# Altium project GimbDrive.PrjPcb
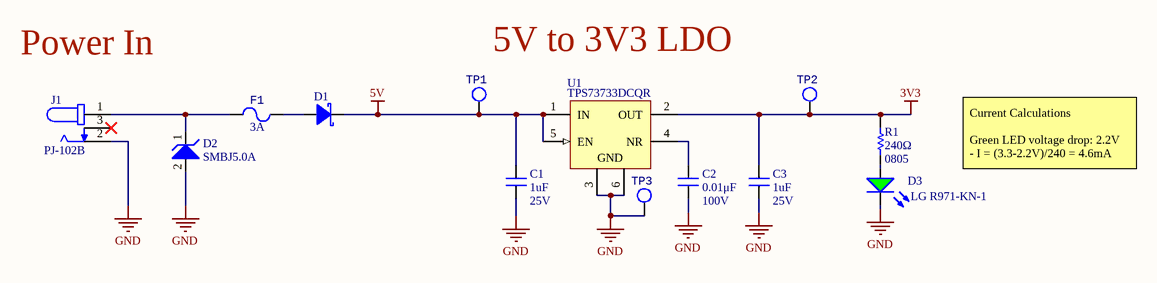
[diagram p0: SH1-POWER.SchDoc]
4 sheets, 114 parts. Net scope: flat (ports and power ports of the same name join across sheets).
Sheets:
  SH1-POWER.SchDoc
  SH2-MCU.SchDoc
  SH3-USB AND UART.SchDoc
  SH4-CONTROLS.SchDoc

## Sheet SH1-POWER.SchDoc: RC GimbDrive - Power
size Letter; DrawnBy: Christopher Arjune; SheetNumber: 1; SheetTotal: 4

### Parts
C1  Capacitance: 1uF  Voltage Rating (DC): 25V  [CAPC2012X140N]
C2  value 0.01μF  Voltage Rating: 100V  [CAP2012]  (hidden comment: CAP_0.01uF_100V_0805)
C3  Capacitance: 1uF  Voltage Rating (DC): 25V  [CAPC2012X140N]
D1  DIO_SCHOTTKY_30V_2A  [SOD-128]  (value not drawn)
D2  TVS_DIODE_UNIDIR_5V  [SMBJ5.0A]  (value not drawn)
D3  LG R971-KN-1  [LED_0805_LINE]
F1  Current Rating: 3A  [FUSE_1206]  (hidden comment: FUSE_3A_1206)
J1  PJ-102B  [CUI_PJ-102B]
R1  Resistance: 240Ω  Case Code (Imperial): 0805  [RESC2012X60N]  (hidden comment: 240)
TP1  TESTPOINT_LOOP  [TESTPOINT_LOOP]  (value not drawn)
TP2  TESTPOINT_LOOP  [TESTPOINT_LOOP]  (value not drawn)
TP3  TESTPOINT_LOOP  [TESTPOINT_LOOP]  (value not drawn)
U1  TPS73733DCQR  [SOT-223-6]

### Nets
3V3: C3.2 R1.2 TP2.1 U1.2(OUT)
5V: C1.1 D1.2(Cathode) TP1.1 U1.1(IN) U1.5(EN)
GND: C1.2 C2.1 C3.1 D2.2 D3.2(K) J1.2 TP3.1 U1.3(GND) U1.6(GND)
NetC2_2: C2.2 U1.4(NR)
NetD1_1: D1.1(Anode) F1.2
NetD2_1: D2.1 F1.1 J1.1
NetD3_1: D3.1(A) R1.1

Not connected (* = marked no-connect by the designer): J1 3*

### Notes on the sheet
- (near J1) Power In
- 5V to 3V3 LDO
- Current Calculations
  Green LED voltage drop: 2.2V
  - I = (3.3-2.2V)/240 = 4.6mA
- Title
- Size:
- Date:
- Letter
- Drawn By:
- Sheet
- of
- File:

### Library data of the parts
C1 C3 = CAP_1uF_25V_0805: CAP CER 1UF 25V X7R 0805; Manufacturer 1: Murata; Manufacturer Part Number 1: GCM21BR71E105KA56K; Tolerance: 10%; Supplier 1: Digi-Key; Stock 1: 31473; Pricing 1: 1=0.34000, 10=0.23600, 100=0.13360, 500=0.09432, 1000=0.08254, 2500=0.07861, 5000=0.07271 (USD); RoHS: Yes; Mount: Surface Mount; Case/Package: 0805; Case Code (Metric): 2012; Case Code (Imperial): 0805; Min Operating Temperature: -55°C; Max Operating Temperature: 125°C; Package Quantity: 10000; Voltage Rating: 25V; Packaging: Tape and Reel; Dielectric: X7R; Termination: SMD/SMT; Length: 2mm; Height: 1.25mm; Width: 0.049inch; Thickness: 0.055inch; Depth: 1.25mm; Ratings: AEC-Q200; Radiation Hardening: No; ComponentLink1URL: https://datasheet.ciiva.com/169/product-169236.pdf?src-supplier=Digi-Key; ComponentLink1Description: https://datasheet.ciiva.com/169/product-169236.pdf?src-supplier=Digi-Key; ComponentLink2URL: https://datasheet.ciiva.com/11616/product-11616618.pdf?src-supplier=Avnet; ComponentLink2Description: https://datasheet.ciiva.com/11616/product-11616618.pdf?src-supplier=Avnet; Supplier Part Number 1: 490-14743-1-ND
C2 = CAP_0.01uF_100V_0805: CAP CER 10000PF 100V X7R 0805; Manufacturer 1: KEMET; Manufacturer Part Number 1: C0805C103K1RACTU; Tolerance: 10%; Mount: Surface Mount; Case Code (Metric): 2012; Case Code (Imperial): 0805; Min Operating Temperature: -55°C; Max Operating Temperature: 125°C; Termination: SMD/SMT; Supplier 1: Digi-Key; Supplier Part Number 1: 399-1159-1-ND; Package: 0805 (2012 Metric); Dielectric: X7R
D1 = DIO_SCHOTTKY_30V_2A: DIODE SCHOTTKY 30V 2A PMDTM; Manufacturer 1: Rohm Semiconductor; Manufacturer Part Number 1: RSX205LAM30TR; Vf (Max): 490mV; Supplier 1: Digi-Key; Supplier Part Number 1: RSX205LAM30CT-ND; Mount: Surface Mount; Vr (Max): 30V; Io: 2A
D2 = TVS_DIODE_UNIDIR_5V: TVS DIODE 5V 9.2V DO214AA; Manufacturer 1: Bourns; Operating Supply Voltage: 3.5V; Max Surge Current: 100A; Reverse Breakdown Voltage: 6.4V; Peak Pulse Power: 600W; Power Line Protection: No; Breakdown Voltage: 7.25V; Number of Channels: 1; Polarity: Unidirectional; Max Reverse Leakage Current: 800uA; Test Current: 10mA; Peak Pulse Current: 65.2A; Supplier 1: Digi-Key; Mount: Surface Mount; Number of Pins: 2; Min Operating Temperature: -55°C; Max Operating Temperature: 150°C; Reverse Standoff Voltage: 5V; Clamping Voltage: 9.2V; Max Power Dissipation: 600W; Max Breakdown Voltage: 7.25V; Leakage Current: 800uA; Composition: Zener; Supplier Part Number 1: SMBJ5.0ABCT-ND; Zener Voltage: *; Min Breakdown Voltage: 6.4V; Manufacturer Part Number 1: SMBJ5.0A
D3 = DIO_LED_G: LED GREEN DIFFUSED 0805 SMD; Manufacturer 1: OSRAM; Forward Voltage Drop: 2.2V; Package: 0805 (2012 Metric); Manufacturer Part Number 1: LG R971-KN-1; Supplier Part Number 1: 475-1410-1-ND; Supplier 1: Digi-Key; Mount: Surface Mount
F1 = FUSE_3A_1206: FUSE SMD 3A 32V 1206; Manufacturer 1: Littelfuse; Manufacturer Part Number 1: 0466003.NR; DC Cold Resistance: 0.02R; Power Dissipation: 228mW; Fuse Type: Board Mount (Cartridge Style Excluded); Approvals: UL,CSA; Response Time: Fast Blow; Supplier 1: Digi-Key; Mount: Surface Mount; Case/Package: 1206; Number of Pins: 2; Case Code (Metric): 3216; Case Code (Imperial): 1206; Min Operating Temperature: -55°C; Max Operating Temperature: 90°C; Voltage Rating (AC): 32V; Voltage Rating (DC): 32V; Composition: Thin Film; Resistance: 0.02R; Fuse Current: 3A; Working Voltage: 32V; Length: 3.18mm; Height: 0.023inch; Width: 1.52mm; REACH SVHC: Unknown; Supplier Part Number 1: F1458CT-ND
J1 = PJ-102B: CONN PWR JACK 2.5X5.5MM SOLDER; Manufacturer 1: CUI; Gender: Male; Shielding: Unshielded; Current Rating: 2.5A; Voltage Rating: 24V; Insulation Resistance: 100MR; Number of Conductors: 2; Supplier 1: Digi-Key; Manufacturer Part Number 1: PJ-102B; Mount: Through Hole; Color: Black; Contact Plating: Nickel; Contact Material: Copper; Housing Material: Thermoplastic; Housing Color: Black; Min Operating Temperature: -25°C; Max Operating Temperature: 85°C; Termination: Through Hole; Connector Type: Jack; Contact Gender: Male; Orientation: Horizontal; Diameter: 2.5mm; Flammability Rating: UL94 V-0; Supplier Part Number 1: CP-102B-ND
R1 = RES_120Ω_0805_1%: RES 240 OHM 1% 1/8W 0805; Manufacturer 1: Vishay; Manufacturer Part Number 1: CRCW0805240RFKEA; Temperature Coefficient: 100ppm/°C; Max Power Dissipation: 125mW; Voltage Rating (DC): 150V; Supplier 1: Digi-Key; Stock 1: 27214; Pricing 1: 1=0.10000, 10=0.05700, 100=0.02310, 1000=0.01039, 2500=0.00902 (USD); RoHS: Yes; Case/Package: 0805; Case Code (Metric): 2012; Contact Plating: Tin; Weight: 0.000194oz; Min Operating Temperature: -55°C; Max Operating Temperature: 155°C; Tolerance: 1%; Packaging: Tape and Reel; Package Quantity: 10; Resistor Type: Thick Film; Number of Terminations: 2; Features: Automotive AEC-Q200; Power Rating: 125mW; Voltage Rating: 150V; Termination: SMD/SMT; Length: 2mm; Width: 0.049inch; Height: 0.45mm; Depth: 1.25mm; Radiation Hardening: No; Lead Free: Lead Free; REACH SVHC: Unknown; Military Standard: Not; ComponentLink1URL: https://datasheet.ciiva.com/11810/0900766b80d98b26-11810664.pdf?src-supplier=RSComponents; ComponentLink1Description: https://datasheet.ciiva.com/11810/0900766b80d98b26-11810664.pdf?src-supplier=RSComponents; ComponentLink2URL: https://datasheet.ciiva.com/2467/dcrcwe3-2467397.pdf?src-supplier=Digi-Key; ComponentLink2Description: https://datasheet.ciiva.com/2467/dcrcwe3-2467397.pdf?src-supplier=Digi-Key; ComponentLink3URL: https://datasheet.ciiva.com/5541/dcrcwe3-109170-5541461.pdf?src-supplier=Mouser; ComponentLink3Description: https://datasheet.ciiva.com/5541/dcrcwe3-109170-5541461.pdf?src-supplier=Mouser; ComponentLink4URL: https://datasheet.ciiva.com/2467/dcrcwe3-2467395.pdf?src-supplier=Digi-Key; ComponentLink4Description: https://datasheet.ciiva.com/2467/dcrcwe3-2467395.pdf?src-supplier=Digi-Key; ComponentLink5URL: https://datasheet.ciiva.com/2467/dcrcwe3-2467396.pdf?src-supplier=Digi-Key; ComponentLink5Description: https://datasheet.ciiva.com/2467/dcrcwe3-2467396.pdf?src-supplier=Digi-Key; ComponentLink6URL: https://datasheet.ciiva.com/15159/getdatasheetpartid-101887-15159995.pdf?src-supplier=Verical; ComponentLink6Description: https://datasheet.ciiva.com/15159/getdatasheetpartid-101887-15159995.pdf?src-supplier=Verical; ComponentLink7URL: https://datasheet.ciiva.com/16435/dcrcwe3-16435931.pdf?src-supplier=Future+Electronics; ComponentLink7Description: https://datasheet.ciiva.com/16435/dcrcwe3-16435931.pdf?src-supplier=Future+Electronics; ComponentLink8URL: https://datasheet.ciiva.com/26317/fld-crcw-e3-data-en-26317341.pdf?src-supplier=Distrelec; ComponentLink8Description: https://datasheet.ciiva.com/26317/fld-crcw-e3-data-en-26317341.pdf?src-supplier=Distrelec; Supplier Part Number 1: 541-240CCT-ND
TP1-TP3 = TESTPOINT_LOOP: Loop testpoint through-hole pad; Manufacturer 1: Keystone Electronics; Manufacturer Part Number 1: 5002; Supplier Part Number 1: 36-5002-ND; Supplier 1: Digi-Key; Mount: Through Hole
U1 = CMP-0395-00300-2: IC REG LINEAR 3.3V 1A SOT223-6; Manufacturer: Texas Instruments; Fixed Output Options(V): 3.3; Vdo(Typ)(mV): 130; Iout(Max)(A): 1; Accuracy(%): 3; SubFamily: Single Channel LDO; Eco-Plan: Green (RoHS & no Sb/Br); Vin(Min)(V): 2.2; Vin(Max)(V): 5.5; Rating: Catalog; Iq(Typ)(mA): 0.3; PartNumber: TPS73733DCQR; DatasheetVersion: SBVS067O; PackageReference: DCQ0006A; PackageDescription: 6-Pin Plastic Small Outline, Body 3.5 x 6.5 mm, Pitch 1.27 mm; PackageVersion: 4202109/D; Vout Adj(Min)(V): 3.3; Vout Adj(Max)(V): 3.3; Mounting Technology: Surface Mount; Supplier 1: Digi-Key; Supplier Part Number 1: 296-22681-2-ND; Manufacturer 1: Texas Instruments; Manufacturer Part Number 1: TPS73733DCQR

## Sheet SH2-MCU.SchDoc: RC GimbDrive - Microcontroller
size Letter; DrawnBy: Christopher Arjune; SheetNumber: 2; SheetTotal: 4
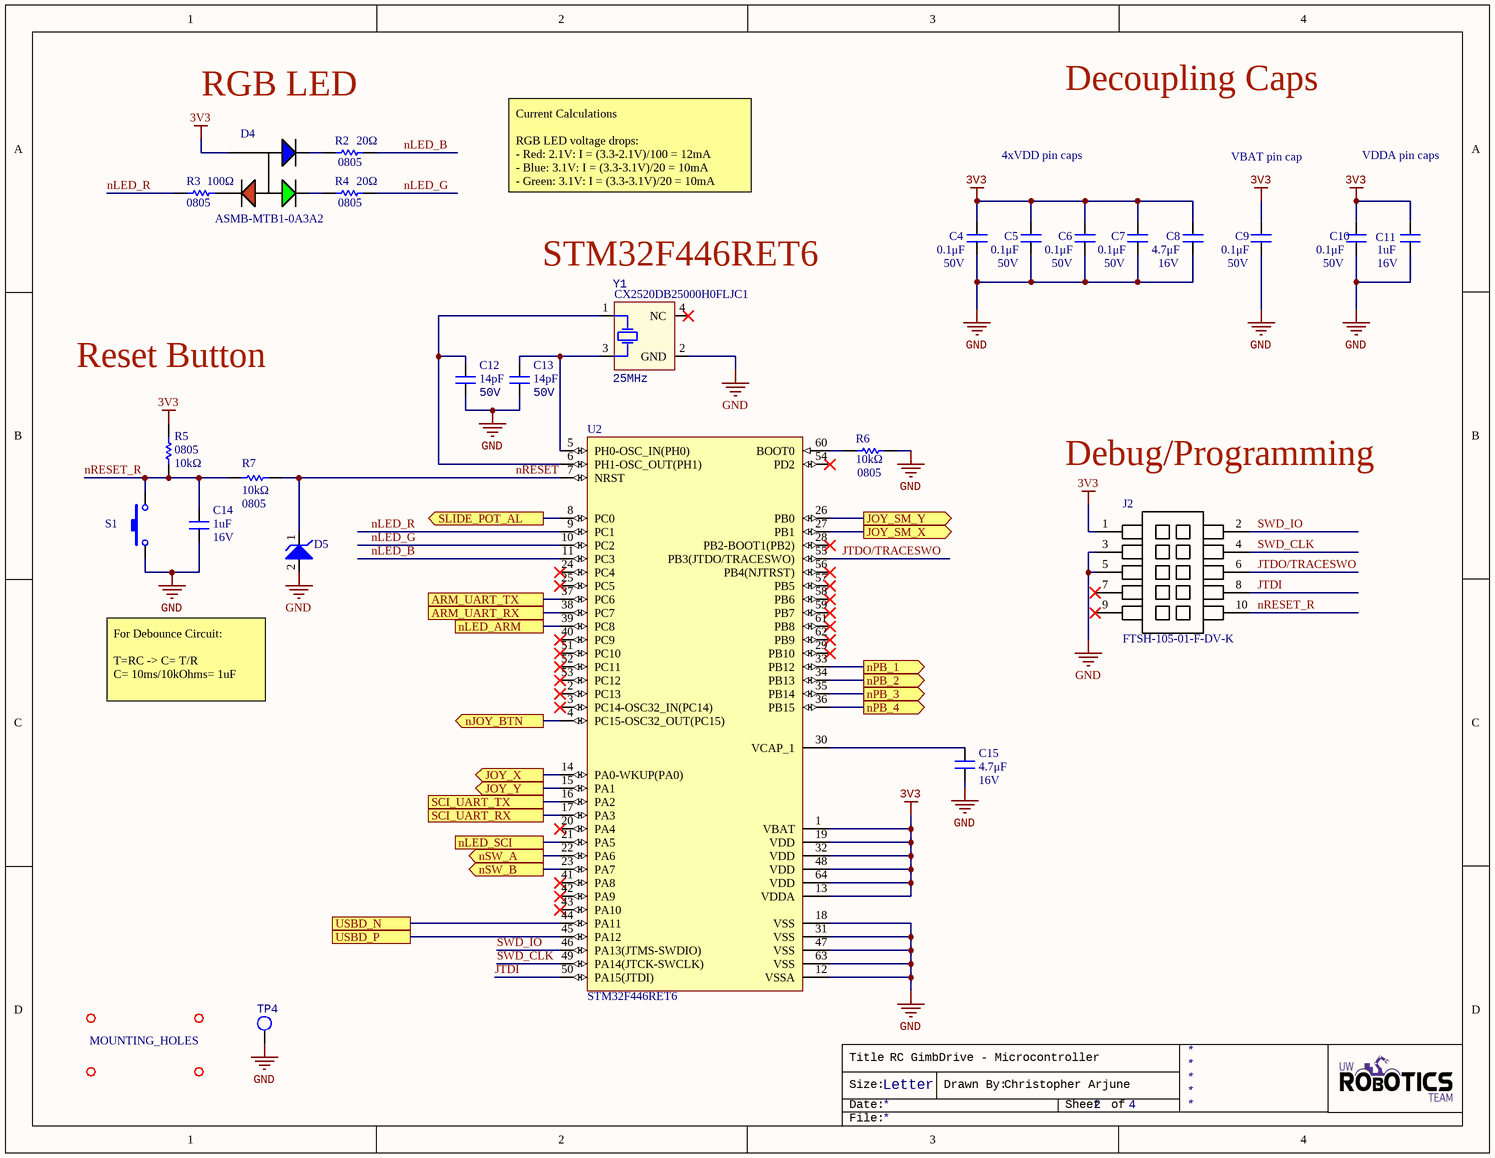
[diagram p1: SH2-MCU.SchDoc]

### Parts
C4  Voltage Rating: 50V  [CAPC2012X140N]  (hidden comment: 0.1μF)
C5  Voltage Rating: 50V  [CAPC2012X140N]  (hidden comment: 0.1μF)
C6  Voltage Rating: 50V  [CAPC2012X140N]  (hidden comment: 0.1μF)
C7  Voltage Rating: 50V  [CAPC2012X140N]  (hidden comment: 0.1μF)
C8  value 4.7μF  Voltage Rating: 16V  [CAPC2012X140N]  (hidden comment: CAP_4.7uF_16V_0805)
C9  Voltage Rating: 50V  [CAPC2012X140N]  (hidden comment: 0.1μF)
C10  Voltage Rating: 50V  [CAPC2012X140N]  (hidden comment: 0.1μF)
C11  value 1uF  Voltage Rating: 16V  [CAPC2012X140N]  (hidden comment: CAP_1uF_16V_0805)
C12  value 14pF  Voltage Rating (DC): 50V  [CAPC0603(1608)55_N]  (hidden comment: CL10C140JB8NNNC)
C13  value 14pF  Voltage Rating (DC): 50V  [CAPC0603(1608)55_N]  (hidden comment: CL10C140JB8NNNC)
C14  value 1uF  Voltage Rating: 16V  [CAPC2012X140N]  (hidden comment: CAP_1uF_16V_0805)
C15  value 4.7μF  Voltage Rating: 16V  [CAPC2012X140N]  (hidden comment: CAP_4.7uF_16V_0805)
D4  Manufacturer Part Number 1: ASMB-MTB1-0A3A2  [LED_RGB]  (hidden comment: LED_RGB)
D5  TVS_DIODE_UNIDIR_3.3V  [SOD523]  (value not drawn)
J2  Manufacturer Part Number 1: FTSH-105-01-F-DV-K  [FTSH-105-01-F-DV-K-P-TR]  (hidden comment: CON_PROGRAMMING)
MH1  MOUNTING_HOLES  [MOUNTING_HOLE]  (value not drawn)
MH2  MOUNTING_HOLES  [MOUNTING_HOLE]  (value not drawn)
MH3  MOUNTING_HOLES  [MOUNTING_HOLE]
MH4  MOUNTING_HOLES  [MOUNTING_HOLE]  (value not drawn)
R2  value 20Ω  Case Code (Imperial): 0805  [RESC2012X60N]  (hidden comment: RES_20Ω_0805)
R3  value 100Ω  Case Code (Imperial): 0805  [RESC2012X60N]  (hidden comment: RES_100Ω_0805)
R4  value 20Ω  Case Code (Imperial): 0805  [RESC2012X60N]  (hidden comment: RES_20Ω_0805)
R5  value 10kΩ  Case Code (Imperial): 0805  [RESC2012X60N]  (hidden comment: RES_10kΩ_0805)
R6  value 10kΩ  Case Code (Imperial): 0805  [RESC2012X60N]  (hidden comment: RES_10kΩ_0805)
R7  value 10kΩ  Case Code (Imperial): 0805  [RESC2012X60N]  (hidden comment: RES_10kΩ_0805)
S1  SW_TACTILE  [B3U-1000P]  (value not drawn)
TP4  TESTPOINT_LOOP  [TESTPOINT_LOOP]  (value not drawn)
U2  STM32F446RET6  [STM-LQFP64_L]
Y1  Manufacturer Part Number 1: CX2520DB25000H0FLJC1  Frequency: 25MHz  [SOIC254P1016X440-4N]  (hidden comment: CRYSTAL_25MHZ)

### Ports
ARM_UART_RX, ARM_UART_TX, JOY_SM_X (out), JOY_SM_Y (out), JOY_X (out), JOY_Y (out), nJOY_BTN (out), nLED_ARM, nLED_SCI, nPB_1 (out), nPB_2 (out), nPB_3 (out), nPB_4 (out), nSW_A (out), nSW_B (out), SCI_UART_RX, SCI_UART_TX, SLIDE_POT_AL (out), USBD_N, USBD_P

### Nets
3V3: C4.2 C5.2 C6.2 C7.2 C8.2 C9.2 C10.2 C11.2 D4.4 J2.1 R5.2 U2.1(VBAT) U2.13(VDDA) U2.19(VDD) U2.32(VDD) U2.48(VDD) U2.64(VDD)
GND: C4.1 C5.1 C6.1 C7.1 C8.1 C9.1 C10.1 C11.1 C12.1 C13.1 C14.1 C15.1 D5.2 J2.3 J2.5 R6.2 S1.2 TP4.1 U2.12(VSSA) U2.18(VSS) U2.31(VSS) U2.47(VSS) U2.63(VSS) Y1.2(GND)
JTDI: J2.8 U2.50(PA15(JTDI))
JTDO/TRACESWO: J2.6 U2.55(PB3(JTDO/TRACESWO))
nLED_B: R2.2 U2.11(PC3)
nLED_G: R4.2 U2.10(PC2)
nLED_R: R3.1 U2.9(PC1)
nRESET: D5.1 R7.2 U2.7(NRST)
nRESET_R: C14.2 J2.10 R5.1 R7.1 S1.1
SWD_CLK: J2.4 U2.49(PA14(JTCK-SWCLK))
SWD_IO: J2.2 U2.46(PA13(JTMS-SWDIO))
USBD_N: U2.44(PA11) ; port USBD_N
USBD_P: U2.45(PA12) ; port USBD_P
NetC12_2: C12.2 U2.6(PH1-OSC_OUT(PH1)) Y1.1(HOT)
NetC13_2: C13.2 U2.5(PH0-OSC_IN(PH0)) Y1.3(HOT)
NetC15_2: C15.2 U2.30(VCAP_1)
NetC17_2: U2.8(PC0) ; port SLIDE_POT_AL
NetC18_2: U2.33(PB12) ; port nPB_1
NetC19_2: U2.26(PB0) ; port JOY_SM_Y
NetC20_2: U2.27(PB1) ; port JOY_SM_X
NetC21_2: U2.34(PB13) ; port nPB_2
NetC22_2: U2.35(PB14) ; port nPB_3
NetC23_2: U2.4(PC15-OSC32_OUT(PC15)) ; port nJOY_BTN
NetC24_2: U2.14(PA0-WKUP(PA0)) ; port JOY_X
NetC25_2: U2.15(PA1) ; port JOY_Y
NetC26_2: U2.36(PB15) ; port nPB_4
NetC27_2: U2.22(PA6) ; port nSW_A
NetC28_2: U2.23(PA7) ; port nSW_B
NetD4_1: D4.1 R3.2
NetD4_2: D4.2 R4.1
NetD4_3: D4.3 R2.1
NetD9_1: U2.38(PC7) ; port ARM_UART_RX
NetD10_1: U2.37(PC6) ; port ARM_UART_TX
NetD12_1: U2.17(PA3) ; port SCI_UART_RX
NetD13_1: U2.16(PA2) ; port SCI_UART_TX
NetR6_1: R6.1 U2.60(BOOT0)
NetR11_1: U2.39(PC8) ; port nLED_ARM
NetR12_1: U2.21(PA5) ; port nLED_SCI

Not connected (* = marked no-connect by the designer): J2 7* 9*; U2 2(PC13)* 3(PC14-OSC32_IN(PC14))* 20(PA4)* 24(PC4)* 25(PC5)* 28(PB2-BOOT1(PB2))* 29(PB10)* 40(PC9)* 41(PA8)* 42(PA9)* 43(PA10)* 51(PC10)* 52(PC11)* 53(PC12)* 54(PD2)* 56(PB4(NJTRST))* 57(PB5)* 58(PB6)* 59(PB7)* 61(PB8)* 62(PB9)*; Y1 4(NC)*

### Notes on the sheet
- RGB LED
- Decoupling Caps
- 4xVDD pin caps
- VBAT pin cap
- VDDA pin caps
- Current Calculations
  RGB LED voltage drops:
  - Red: 2.1V: I = (3.3-2.1V)/100 = 12mA
  - Blue: 3.1V: I = (3.3-3.1V)/20 = 10mA
  - Green: 3.1V: I = (3.3-3.1V)/20 = 10mA
- (near Y1) STM32F446RET6
- Reset Button
- Debug/Programming
- For Debounce Circuit:
  T=RC -> C= T/R
  C= 10ms/10kOhms= 1uF
- Title
- Size:
- Date:
- Letter
- Drawn By:
- Sheet
- of
- File:

### Library data of the parts
C4-C7 C9 C10 = CAP_0.1uF_50V_0805: CAP CER 0.1UF 50V X7R 0805; Manufacturer 1: Murata Electronics; Manufacturer Part Number 1: GCD21BR71H104KA01L; Tolerance: 10%; Mount: Surface Mount; Case Code (Metric): 2012; Case Code (Imperial): 0805; Min Operating Temperature: -55°C; Max Operating Temperature: 125°C; Dielectric: X7R; Termination: SMD/SMT; Length: 2mm; Height: 1.25mm; Width: 0.049inch; Thickness: 0.049inch; Depth: 1.25mm; Ratings: AEC-Q200; ComponentLink1URL: https://datasheet.ciiva.com/29537/c03e-29537701.pdf?src-supplier=Digi-Key; ComponentLink1Description: https://datasheet.ciiva.com/29537/c03e-29537701.pdf?src-supplier=Digi-Key; Supplier 1: Digi-Key; Supplier Part Number 1: 490-11955-1-ND; Value: 0.1μF; Package: 0805 (2012 Metric)
C8 C15 = CAP_4.7uF_16V_0805: CAP CER 4.7UF 16V X5R 0805; Manufacturer 1: Samsung Electro-Mechanics; Manufacturer Part Number 1: CL21A475KOFNNNE; Tolerance: 10%; Mount: Surface Mount; Case Code (Metric): 2012; Case Code (Imperial): 0805; Min Operating Temperature: -55°C; Max Operating Temperature: 85°C; Dielectric: X5R; Termination: SMD/SMT; Supplier 1: Digi-Key; Supplier Part Number 1: 1276-1065-1-ND; Package: 0805 (2012 Metric)
C11 C14 = CAP_1uF_16V_0805: CAP CER 1UF 16V X7R 0805; Manufacturer 1: Yageo; Manufacturer Part Number 1: CC0805KKX7R7BB105; Tolerance: 10%; Mount: Surface Mount; Case Code (Metric): 2012; Case Code (Imperial): 0805; Min Operating Temperature: -55°C; Max Operating Temperature: 125°C; Dielectric: X7R; Termination: SMD/SMT; Supplier 1: Digi-Key; Supplier Part Number 1: 311-1365-1-ND; Package: 0805 (2012 Metric)
C12 C13 = CL10C140JB8NNNC: Cap Ceramic 14pF 50V C0G 5% SMD 0603 125C Cardboard T/R; Manufacturer 1: Samsung; Voltage Rating: 50V; Supplier Part Number 1: 1276-2187-1-ND; Supplier 1: Digi-Key; Manufacturer Part Number 1: CL10C140JB8NNNC; Stock 1: 187088; Pricing 1: 1=0.10000, 10=0.06700, 100=0.02980, 500=0.02130, 1000=0.01673 (USD); RoHS: Yes; Mount: Surface Mount; Case/Package: 0603; Case Code (Metric): 1608; Case Code (Imperial): 0603; Min Operating Temperature: -55°C; Max Operating Temperature: 125°C; Tolerance: 5%; Package Quantity: 1; Packaging: Tape and Reel; Dielectric: C0G; Length: 1.6mm; Height: 0.8mm; Width: 0.031inch; Depth: 0.8mm; Thickness: 0.035inch; Radiation Hardening: No; ComponentLink1URL: https://datasheet.ciiva.com/25782/cl10c140jb8nnnc-25782947.pdf?src-supplier=Digi-Key; ComponentLink1Description: https://datasheet.ciiva.com/25782/cl10c140jb8nnnc-25782947.pdf?src-supplier=Digi-Key; Capacitance: 14pF
D4 = LED_RGB: LED RGB DIFFUSED 4PLCC SMD; Manufacturer 1: Broadcom; Color: Blue,Green,Red; Lens Color: White; Viewing Angle: 115°; Lens Style: Round; Luminous Intensity: 350mcd; Dominant Wavelength: 470nm; Forward Voltage: 3.1V; Test Current: 20mA; Supplier 1: Digi-Key; Stock 1: 142531; Pricing 1: 1=0.60000, 10=0.47100, 100=0.30210, 500=0.25980, 1000=0.20059 (USD); RoHS: Yes; Mount: Surface Mount; Case/Package: PLCC; Number of Pins: 4; Packaging: Cut Tape; Lens Transparency: Diffused; Length: 3.2mm; Height: 1.9mm; Width: 2.8mm; REACH SVHC: No SVHC; ComponentLink1URL: http://www.farnell.com/datasheets/2111106.pdf?src-supplier=Farnell; ComponentLink1Description: http://www.farnell.com/datasheets/2111106.pdf?src-supplier=Farnell; ComponentLink2URL: https://docs.broadcom.com/docs/AV02-4194EN?src-supplier=Digi-Key; ComponentLink2Description: https://docs.broadcom.com/docs/AV02-4194EN?src-supplier=Digi-Key; ComponentLink3URL: http://www.farnell.com/datasheets/1801564.pdf?src-supplier=Element14; ComponentLink3Description: http://www.farnell.com/datasheets/1801564.pdf?src-supplier=Element14; ComponentLink4URL: http://www.farnell.com/datasheets/2111106.pdf?src-supplier=Newark; ComponentLink4Description: http://www.farnell.com/datasheets/2111106.pdf?src-supplier=Newark; Supplier Part Number 1: 516-3280-1-ND
D5 = TVS_DIODE_UNIDIR_3.3V: TVS DIODE 3.3V 14.1V SOD523. Used to protect each connector input line going into the MCU.; Manufacturer 1: ON Semiconductor; Manufacturer Part Number 1: ESD5Z3.3T1G; Reverse Breakdown Voltage: 5V; Peak Pulse Power: 158W; Power Line Protection: No; Number of Channels: 1; Polarity: Unidirectional; Peak Pulse Current: 11.2A; Supplier 1: Digi-Key; Mount: Surface Mount; Number of Pins: 2; Min Operating Temperature: -55°C; Max Operating Temperature: 150°C; Reverse Standoff Voltage: 3.3V; Clamping Voltage: 14.1V; Composition: Zener; Supplier Part Number 1: ESD5Z3.3T1GOSCT-ND
J2 = CON_PROGRAMMING: Board Connector, 10 Contact(s), 2 Row(s), Male, Straight, 0.05 inch Pitch, Surface Mount Terminal, Locking; Manufacturer 1: Samtec; Number of Contacts: 10; Connector Type: Male Pin; Max Current Rating: 1.75A; Pitch: 1.27mm; Supplier 1: Digi-Key; RoHS: Yes; Category: Headers and Wire Housings; Stock 1: 19926; Pricing 1: 1=2.90000, 10=2.78400, 100=2.32000, 500=1.97200, 1000=1.68200, 5000=1.50800 (USD); Mount: Surface Mount; Contact Plating: Gold; Contact Material: Copper,Bronze; Housing Color: Black; Housing Material: Polymer; Color: Black; Min Operating Temperature: -55°C; Max Operating Temperature: 125°C; Number of Rows: 2; Termination: Solder; Packaging: Rail/Tube; Orientation: Straight; Package Quantity: 1; Number of Positions: 10; Length: 15.2mm; Height: 3.3mm; Depth: 3.43mm; Row Spacing: 0.05inch; Contact Mating Length: 0.12inch; Radiation Hardening: No; Lead Free: Lead Free; ComponentLink1URL: https://datasheet.ciiva.com:443/pdfs/VipMasterIC/IC/SAMI/SAMI-S-A0003531380/SAMI-S-A0003531380-1.pdf?src-supplier=IHS+Markit; ComponentLink1Description: https://datasheet.ciiva.com:443/pdfs/VipMasterIC/IC/SAMI/SAMI-S-A0003531380/SAMI-S-A0003531380-1.pdf?src-supplier=IHS+Markit; ComponentLink2URL: https://datasheet.ciiva.com/19461/2046846-19461026.pdf?src-supplier=Jameco; ComponentLink2Description: https://datasheet.ciiva.com/19461/2046846-19461026.pdf?src-supplier=Jameco; ComponentLink3URL: https://datasheet.ciiva.com/16657/ftsh-mt-16657371.pdf?src-supplier=Avnet+Europe; ComponentLink3Description: https://datasheet.ciiva.com/16657/ftsh-mt-16657371.pdf?src-supplier=Avnet+Europe; ComponentLink4URL: https://datasheet.ciiva.com/15195/getdatasheetpartid-133463-15195260.pdf?src-supplier=Verical; ComponentLink4Description: https://datasheet.ciiva.com/15195/getdatasheetpartid-133463-15195260.pdf?src-supplier=Verical; ComponentLink5URL: https://datasheet.ciiva.com/738/ftsh-1xx-xx-xxx-dv-xxx-mkt-738998.pdf?src-supplier=Digi-Key; ComponentLink5Description: https://datasheet.ciiva.com/738/ftsh-1xx-xx-xxx-dv-xxx-mkt-738998.pdf?src-supplier=Digi-Key; ComponentLink6URL: https://datasheet.ciiva.com/10245/ftsh-mt-10245273.pdf?src-supplier=Avnet; ComponentLink6Description: https://datasheet.ciiva.com/10245/ftsh-mt-10245273.pdf?src-supplier=Avnet; Supplier Part Number 1: SAM8796-ND
MH1-MH4 = MOUNTING_HOLES: 6cm x 6cm
R2 R4 = RES_20Ω_0805: RES SMD 20 OHM 1% 1/8W 0805; Manufacturer 1: Yageo; Manufacturer Part Number 1: RC0805FR-0720RL; Resistance: 20; Power Rating: 125mW; Supplier 1: Digi-Key; Case Code (Metric): 2012; Min Operating Temperature: -55°C; Max Operating Temperature: 155°C; Tolerance: 1%; Termination: SMD/SMT; Supplier Part Number 1: 311-20.0CRCT-ND; Package: 0805 (2012 Metric)
R3 = RES_100Ω_0805: RES SMD 100 OHM 1% 1/8W 0805; Manufacturer 1: Yageo; Manufacturer Part Number 1: RC0805FR-07100RL; Power Rating: 125mW; Supplier 1: Digi-Key; Mount: Surface Mount; Case Code (Metric): 2012; Supplier Part Number 1: 311-100CRCT-ND; Package: 0805 (2012 Metric)
R5-R7 = RES_10kΩ_0805: RES SMD 10K OHM 1% 1/8W 0805; Manufacturer 1: Yageo; Manufacturer Part Number 1: RC0805FR-0710KL; Power Rating: 125mW; Supplier 1: Digi-Key; Case Code (Metric): 2012; Min Operating Temperature: -55°C; Max Operating Temperature: 155°C; Resistance: 10K; Tolerance: 1%; Termination: SMD/SMT; Supplier Part Number 1: 311-10.0KCRCT-ND; Package: 0805 (2012 Metric)
S1 = SW_TACTILE: Tactile Switch (Grey); Manufacturer 1: Omron Electronics Inc-EMC Div; Manufacturer Part Number 1: B3U-1000P; Supplier 1: Digi-Key; Supplier Part Number 1: SW1020CT-ND; Mount: Surface Mount
TP4 = TESTPOINT_LOOP: Loop testpoint through-hole pad; Manufacturer Part Number 1: 5002; Manufacturer 1: Keystone Electronics; Supplier Part Number 1: 36-5002-ND; Supplier 1: Digi-Key; Mount: Through Hole
U2 = MCU_STM32F446RET6: ARM Cortex-M4 32-bit MCU+FPU, 512 KB Flash, 128 KB Internal RAM, 50 I/Os, 64-Pin LQFP, -40 to 85 degC, Tray; I/Os (High Current): 50; Supply Voltage(Vcc) min (V): 1.7; Operating Frequency(F) (Processor speed) (MHz): 180; D/A Converter: 2; Internal RAM Size (kB): 128; FLASH Size (Prog) (kB): 512; Core: ARM Cortex-M4; ComponentLink1Description: Manufacturer URL; Package Reference: 64-Pin Low-profile Quad Flat Package, Body 10 x 10 mm, Pitch 0.5 mm; ComponentLink2URL: http://www.st.com/st-web-ui/static/active/en/resource/technical/document/datasheet/DM00141306.pdf; Packing: Tray; DatasheetVersion: Rev. 6; ComponentLink1URL: http://www.st.com/; ComponentLink2Description: Datasheet; Package Description: LQFP64; Mounting Technology: Surface Mount; Supplier Part Number 1: 497-15376-ND; Supplier 1: Digi-Key
Y1 = CRYSTAL_25MHZ: CRYSTAL 25.0000MHZ 12PF SMD; Manufacturer 1: Kyocera AVX; ESR (Equivalent Series Resistance): 80R; Frequency Stability: 15ppm; Frequency Tolerance: 10ppm; ComponentLink1Description: https://media.digikey.com/pdf/Data%20Sheets/AVX%20PDFs/CX2520DB_USY1M-H1-16429-00_Spec.pdf?src-supplier=Digi-Key; ComponentLink1URL: https://media.digikey.com/pdf/Data%20Sheets/AVX%20PDFs/CX2520DB_USY1M-H1-16429-00_Spec.pdf?src-supplier=Digi-Key; Supplier 1: Digi-Key; Supplier Part Number 1: 1253-1724-1-ND; Stock 1: 11741; Pricing 1: 1=0.72000, 10=0.63300, 50=0.59120, 100=0.52250, 500=0.49500, 1000=0.41250 (USD); RoHS: Yes; Mount: Surface Mount; Case/Package: SMD/SMT; Min Operating Temperature: -30°C; Max Operating Temperature: 85°C; Packaging: Tape and Reel; Load Capacitance: 12pF; Length: 0.098inch; Height: 0.022inch; Width: 0.079inch; Ratings: AEC-Q200

## Sheet SH3-USB AND UART.SchDoc: RC GimbDrive - USB and UART
size Letter; DrawnBy: Christopher Arjune; SheetNumber: 3; SheetTotal: 4
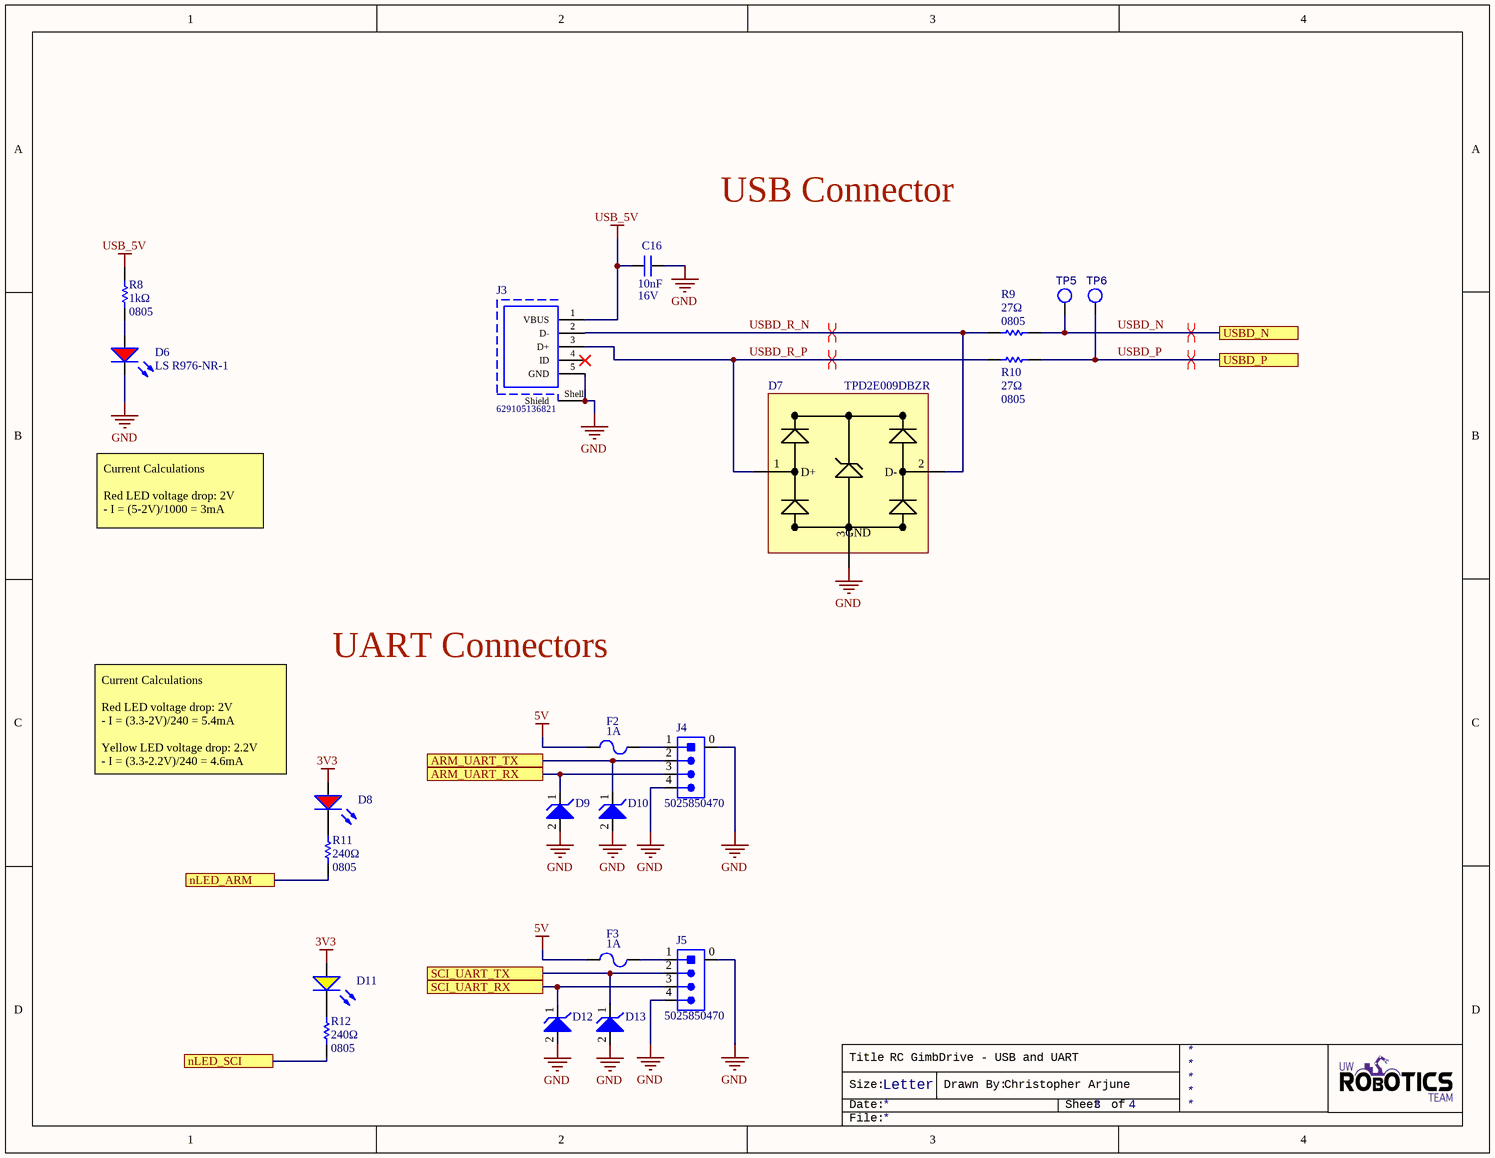
[diagram p2: SH3-USB AND UART.SchDoc]

### Parts
C16  Capacitance: 10nF  Voltage Rating: 16V  [CAPC2012X140N]
D6  LS R976-NR-1  [LED_0805_LINE]
D7  Manufacturer Part Number: TPD2E009DBZR  [SOT23-3]  (hidden comment: TVS_DIODE_USB_5.5V)
D8  LS R976-NR-1  [LED_0805_RED]  (value not drawn)
D9  TVS_DIODE_UNIDIR_3.3V  [SOD523]  (value not drawn)
D10  TVS_DIODE_UNIDIR_3.3V  [SOD523]  (value not drawn)
D11  LY R976-PS-36  [LED_0805_YELLOW]  (value not drawn)
D12  TVS_DIODE_UNIDIR_3.3V  [SOD523]  (value not drawn)
D13  TVS_DIODE_UNIDIR_3.3V  [SOD523]  (value not drawn)
F2  Current Rating: 1A  [FUSC3215X78N]  (hidden comment: FUSE_1A_1206)
F3  Current Rating: 1A  [FUSC3215X78N]  (hidden comment: FUSE_1A_1206)
J3  629105136821  [629105136821]
J4  Manufactor Number: 5025850470  [MOLEX-5025850470]  (hidden comment: CON_4M_SM_RA)
J5  Manufactor Number: 5025850470  [MOLEX-5025850470]  (hidden comment: CON_4M_SM_RA)
R8  1kΩ  Case Code (Imperial): 0805  [RESC2012X60N]
R9  Resistance: 27Ω  Case/Package: 0805  [RESC2012X60N]  (hidden comment: RES_27Ω_0805)
R10  Resistance: 27Ω  Case/Package: 0805  [RESC2012X60N]  (hidden comment: RES_27Ω_0805)
R11  Resistance: 240Ω  Case Code (Imperial): 0805  [RESC2012X60N]  (hidden comment: 240)
R12  Resistance: 240Ω  Case Code (Imperial): 0805  [RESC2012X60N]  (hidden comment: 240)
TP5  TESTPOINT_LOOP  [TESTPOINT_LOOP]  (value not drawn)
TP6  TESTPOINT_LOOP  [TESTPOINT_LOOP]  (value not drawn)

### Ports
ARM_UART_RX, ARM_UART_TX, nLED_ARM, nLED_SCI, SCI_UART_RX, SCI_UART_TX, USBD_N, USBD_P

### Nets
3V3: D8.1(A) D11.1(A)
5V: F2.1 F3.1
GND: C16.2 D6.2(K) D7.3(GND) D9.2 D10.2 D12.2 D13.2 J3.5(GND) J3.Shell(Shield) J4.0 J4.4 J5.0 J5.4
USB_5V: C16.1 J3.1(VBUS) R8.2
USBD_N: R9.2 TP5.1 ; port USBD_N
USBD_P: R10.2 TP6.1 ; port USBD_P
USBD_R_N: D7.2(D-) J3.2(D-) R9.1
USBD_R_P: D7.1(D+) J3.3(D+) R10.1
NetD6_1: D6.1(A) R8.1
NetD8_2: D8.2(K) R11.2
NetD9_1: D9.1 J4.3 ; port ARM_UART_RX
NetD10_1: D10.1 J4.2 ; port ARM_UART_TX
NetD11_2: D11.2(K) R12.2
NetD12_1: D12.1 J5.3 ; port SCI_UART_RX
NetD13_1: D13.1 J5.2 ; port SCI_UART_TX
NetF2_2: F2.2 J4.1
NetF3_2: F3.2 J5.1
NetR11_1: R11.1 ; port nLED_ARM
NetR12_1: R12.1 ; port nLED_SCI

Not connected (* = marked no-connect by the designer): J3 4(ID)*

### Layout directives
differential pair: USBD_N, USBD_P, USBD_R_N, USBD_R_P

### Notes on the sheet
- USB Connector
- Current Calculations
  Red LED voltage drop: 2V
  - I = (5-2V)/1000 = 3mA
- UART Connectors
- (near D8) Current Calculations
  Red LED voltage drop: 2V
  - I = (3.3-2V)/240 = 5.4mA
  Yellow LED voltage drop: 2.2V
  - I = (3.3-2.2V)/240 = 4.6mA
- Title
- Size:
- Date:
- Letter
- Drawn By:
- Sheet
- of
- File:

### Library data of the parts
C16 = CAP_10nF_16V_0805: CAP CER 10000PF 16V X7R 0805; Manufacturer 1: Yageo; Manufacturer Part Number 1: AC0805KRX7R7BB103; Tolerance: 10%; Supplier 1: Digi-Key; Stock 1: 14344; Pricing 1: 1=0.20000, 10=0.13900, 100=0.07060, 500=0.04832, 1000=0.04275 (USD); RoHS: No; Mount: Surface Mount; Case/Package: 0805; Case Code (Imperial): 0805; Case Code (Metric): 2012; Min Operating Temperature: -55°C; Max Operating Temperature: 125°C; Packaging: Cut Tape; Ratings: AEC-Q200; ComponentLink1URL: http://www.yageo.com/NewPortal/_en/search/productDocs.jsp?YageoPartNumber=AC0805KRX7R7BB103&src-supplier=Digi-Key; ComponentLink1Description: http://www.yageo.com/NewPortal/_en/search/productDocs.jsp?YageoPartNumber=AC0805KRX7R7BB103&src-supplier=Digi-Key; Supplier Part Number 1: 311-3161-1-ND
D6 D8 = DIO_LED_R: LED RED DIFFUSED 0805 SMD; Manufacturer 1: OSRAM; Forward Voltage Drop: 2V; Package: 0805 (2012 Metric); Manufacturer Part Number 1: LS R976-NR-1; Supplier Part Number 1: 475-1278-1-ND; Supplier 1: Digi-Key; Mount: Surface Mount
D7 = TVS_DIODE_USB_5.5V: ESD Suppressor Diode Arrays 8KV 3-Pin SOT-23 T/R; Manufacturer: Texas Instruments; Direction: Unidirectional; Operating Supply Voltage: 6V; Capacitance: 0.9pF; Number of Channels: 2; Current Rating: 100nA; Peak Pulse Current: 1A; Element Configuration: Dual; Reverse Standoff Voltage: 5.5V; Min Breakdown Voltage: 9V; Clamping Voltage: 8V; Peak Pulse Power: 45W; Power Line Protection: Yes; Breakdown Voltage: 7V; Interface: LVDS,PCIe,SATA; Supplier 1: Digi-Key; RoHS: Yes; Category: Interface ICs; Stock 1: 98615; Pricing 1: 1=0.56000, 10=0.48000, 25=0.44800, 100=0.33280, 250=0.31616, 500=0.25984, 1000=0.21120 (USD); Case/Package: SOT-23; Number of Pins: 3; Min Operating Temperature: -40°C; Max Operating Temperature: 85°C; Packaging: Tape and Reel; Package Quantity: 1; Number of Bidirectional Channels: 2; Termination: SMD/SMT; Max Power Dissipation: 45W; Working Voltage: 5.5V; Length: 2.92mm; Height: 1mm; Width: 1.3mm; Depth: 1.3mm; Radiation Hardening: No; REACH SVHC: No SVHC; Lead Free: Lead Free; ComponentLink1URL: https://datasheet.ciiva.com/353/tpd2e009-353266.pdf?src-supplier=Digi-Key; ComponentLink1Description: https://datasheet.ciiva.com/353/tpd2e009-353266.pdf?src-supplier=Digi-Key; ComponentLink2URL: https://datasheet.ciiva.com/15134/getdatasheetpartid-243395-15134537.pdf?src-supplier=Verical; ComponentLink2Description: https://datasheet.ciiva.com/15134/getdatasheetpartid-243395-15134537.pdf?src-supplier=Verical; ComponentLink3URL: https://datasheet.ciiva.com/4479/slvs953a-121037-4479453.pdf?src-supplier=Mouser; ComponentLink3Description: https://datasheet.ciiva.com/4479/slvs953a-121037-4479453.pdf?src-supplier=Mouser; ComponentLink4URL: https://datasheet.ciiva.com/353/tpd2e009-353268.pdf?src-supplier=Digi-Key; ComponentLink4Description: https://datasheet.ciiva.com/353/tpd2e009-353268.pdf?src-supplier=Digi-Key; ComponentLink5URL: https://datasheet.ciiva.com/353/tpd2e009-353267.pdf?src-supplier=Digi-Key; ComponentLink5Description: https://datasheet.ciiva.com/353/tpd2e009-353267.pdf?src-supplier=Digi-Key; ComponentLink6URL: https://datasheet.ciiva.com/46384/1707898-46384524.pdf?src-supplier=Element14; ComponentLink6Description: https://datasheet.ciiva.com/46384/1707898-46384524.pdf?src-supplier=Element14; Supplier Part Number 1: 296-24657-1-ND
D9 D10 D12 D13 = TVS_DIODE_UNIDIR_3.3V: as D5 on sheet SH2-MCU; Supplier 1: Digi-Key; Mount: Surface Mount; Number of Pins: 2; Min Operating Temperature: -55°C; Max Operating Temperature: 150°C; Reverse Standoff Voltage: 3.3V; Clamping Voltage: 14.1V; Composition: Zener; Supplier Part Number 1: ESD5Z3.3T1GOSCT-ND
D11 = DIO_LED_Y: LED YELLOW DIFFUSED 0805 SMD; Manufacturer 1: OSRAM; Forward Voltage Drop: 2.2V; Package: 0805 (2012 Metric); Supplier Part Number 1: 475-2560-1-ND; Supplier 1: Digi-Key; Mount: Surface Mount; Manufacturer Part Number 1: LY R976-PS-36
F2 F3 = FUSE_1A_1206: FUSE BOARD MOUNT 1A 125VAC 63VDC; Manufacturer 1: Bel Fuse Inc.; Manufacturer Part Number 1: C1Q 1; Voltage Rating DC: 63V; Supplier 1: Digi-Key; Supplier Part Number 1: 507-1077-1-ND; Mount: Surface Mount
J3 = CMP-1502-03253-1: Micro USB 2.0 Type B Receptacle WR-COM, Horizontal, SMT, with Pads and Pegs; Manufacturer: Wurth Elektronik; Contact Resistance: 30mOhm; Rated Current: 1A; Working Voltage: 30VAC; Datasheet URL: https://katalog.we-online.de/em/datasheet/629105136821.pdf; Mounting Technology: SMT; Publisher: WurthElektronik; Package Reference: 629105136821; Orientation: Horizontal; Packaging: TapeandReel; Part Number: 629105136821; Manufacturer URL: http://www.we-online.de; Connector Type: MicroUSB2.0TypeB; Gender: Receptacle; Operating Temperature: -40to105degC
J4 J5 = CON_4M_SM_RA: CONN HEADER SMD RIGHT ANGLE 1.5 MM PITCH; Manufacturer: Molex; Supplier 1: Digi-Key; Supplier Part Number 1: WM9449CT-ND
R8 = RES_1kΩ_0805: RES SMD 1K OHM 1% 1/8W 0805; Manufacturer 1: Yageo; Manufacturer Part Number 1: RC0805FR-071KL; Power Rating: 125mW; Temperature Coefficient: 25ppm/°C; Voltage Rating: 150V; Supplier 1: Digi-Key; Case Code (Metric): 2012; Min Operating Temperature: -55°C; Max Operating Temperature: 155°C; Resistance: 1K; Tolerance: 1%; Termination: SMD/SMT; Supplier Part Number 1: 311-1.00KCRCT-ND; Package: 0805 (2012 Metric); Value: 1kΩ; RoHS: Yes; Mount: Surface Mount; Case/Package: 0805; Number of Pins: 2; Weight: 0.000194oz; Contact Plating: Tin; Packaging: Tape and Reel; Composition: Thin Film; Number of Terminations: 2; Voltage Rating (DC): 150V; Max Power Dissipation: 125mW; Package Quantity: 1000; Features: Moisture Resistant,Automotive AEC-Q200,Anti-Sulfur; Military Standard: Not; Length: 2mm; Height: 0.022inch; Width: 0.049inch; Depth: 1.25mm; Radiation Hardening: No; Lead Free: Lead Free; REACH SVHC: Unknown; ComponentLink1URL: https://datasheet.ciiva.com/9003/tnpw-e3-9003481.pdf?src-supplier=Avnet; ComponentLink1Description: https://datasheet.ciiva.com/9003/tnpw-e3-9003481.pdf?src-supplier=Avnet; ComponentLink2URL: https://datasheet.ciiva.com/9003/tnpw-e3-9003543.pdf?src-supplier=Avnet; ComponentLink2Description: https://datasheet.ciiva.com/9003/tnpw-e3-9003543.pdf?src-supplier=Avnet
R9 R10 = RES_27Ω_0805_1%: RES 27 OHM 1% 1/8W 0805; Manufacturer 1: Yageo; Manufacturer Part Number 1: RC0805FR-0727RL; Temperature Coefficient: 100ppm/°C; Working Voltage: 150V; Power Rating: 125mW; Supplier 1: Digi-Key; Case Code (Imperial): 0805; Case Code (Metric): 2012; Min Operating Temperature: -55°C; Max Operating Temperature: 155°C; Tolerance: 1%; Composition: Thick Film; Number of Terminations: 2; Termination: SMD/SMT; Voltage Rating: 150V; Military Standard: Not; Length: 2mm; Height: 0.5mm; Width: 1.25mm; Depth: 1.25mm; REACH SVHC: Unknown; Supplier Part Number 1: 311-27.0CRCT-ND
R11 R12 = RES_120Ω_0805_1%: as R1 on sheet SH1-POWER; Supplier 1: Digi-Key; Stock 1: 27214; Pricing 1: 1=0.10000, 10=0.05700, 100=0.02310, 1000=0.01039, 2500=0.00902 (USD); RoHS: Yes; Case/Package: 0805; Case Code (Metric): 2012; Contact Plating: Tin; Weight: 0.000194oz; Min Operating Temperature: -55°C; Max Operating Temperature: 155°C; Tolerance: 1%; Packaging: Tape and Reel; Package Quantity: 10; Resistor Type: Thick Film; Number of Terminations: 2; Features: Automotive AEC-Q200; Power Rating: 125mW; Voltage Rating: 150V; Termination: SMD/SMT; Length: 2mm; Width: 0.049inch; Height: 0.45mm; Depth: 1.25mm; Radiation Hardening: No; Lead Free: Lead Free; REACH SVHC: Unknown; Military Standard: Not; ComponentLink1URL: https://datasheet.ciiva.com/11810/0900766b80d98b26-11810664.pdf?src-supplier=RSComponents; ComponentLink1Description: https://datasheet.ciiva.com/11810/0900766b80d98b26-11810664.pdf?src-supplier=RSComponents; ComponentLink2URL: https://datasheet.ciiva.com/2467/dcrcwe3-2467397.pdf?src-supplier=Digi-Key; ComponentLink2Description: https://datasheet.ciiva.com/2467/dcrcwe3-2467397.pdf?src-supplier=Digi-Key; ComponentLink3URL: https://datasheet.ciiva.com/5541/dcrcwe3-109170-5541461.pdf?src-supplier=Mouser; ComponentLink3Description: https://datasheet.ciiva.com/5541/dcrcwe3-109170-5541461.pdf?src-supplier=Mouser; ComponentLink4URL: https://datasheet.ciiva.com/2467/dcrcwe3-2467395.pdf?src-supplier=Digi-Key; ComponentLink4Description: https://datasheet.ciiva.com/2467/dcrcwe3-2467395.pdf?src-supplier=Digi-Key; ComponentLink5URL: https://datasheet.ciiva.com/2467/dcrcwe3-2467396.pdf?src-supplier=Digi-Key; ComponentLink5Description: https://datasheet.ciiva.com/2467/dcrcwe3-2467396.pdf?src-supplier=Digi-Key; ComponentLink6URL: https://datasheet.ciiva.com/15159/getdatasheetpartid-101887-15159995.pdf?src-supplier=Verical; ComponentLink6Description: https://datasheet.ciiva.com/15159/getdatasheetpartid-101887-15159995.pdf?src-supplier=Verical; ComponentLink7URL: https://datasheet.ciiva.com/16435/dcrcwe3-16435931.pdf?src-supplier=Future+Electronics; ComponentLink7Description: https://datasheet.ciiva.com/16435/dcrcwe3-16435931.pdf?src-supplier=Future+Electronics; ComponentLink8URL: https://datasheet.ciiva.com/26317/fld-crcw-e3-data-en-26317341.pdf?src-supplier=Distrelec; ComponentLink8Description: https://datasheet.ciiva.com/26317/fld-crcw-e3-data-en-26317341.pdf?src-supplier=Distrelec; Supplier Part Number 1: 541-240CCT-ND
TP5 TP6 = TESTPOINT_LOOP: as TP4 on sheet SH2-MCU; Supplier Part Number 1: 36-5002-ND; Supplier 1: Digi-Key; Mount: Through Hole

## Sheet SH4-CONTROLS.SchDoc: RC GimbDrive - Controls
size Letter; DrawnBy: Christopher Arjune; SheetNumber: 4; SheetTotal: 4
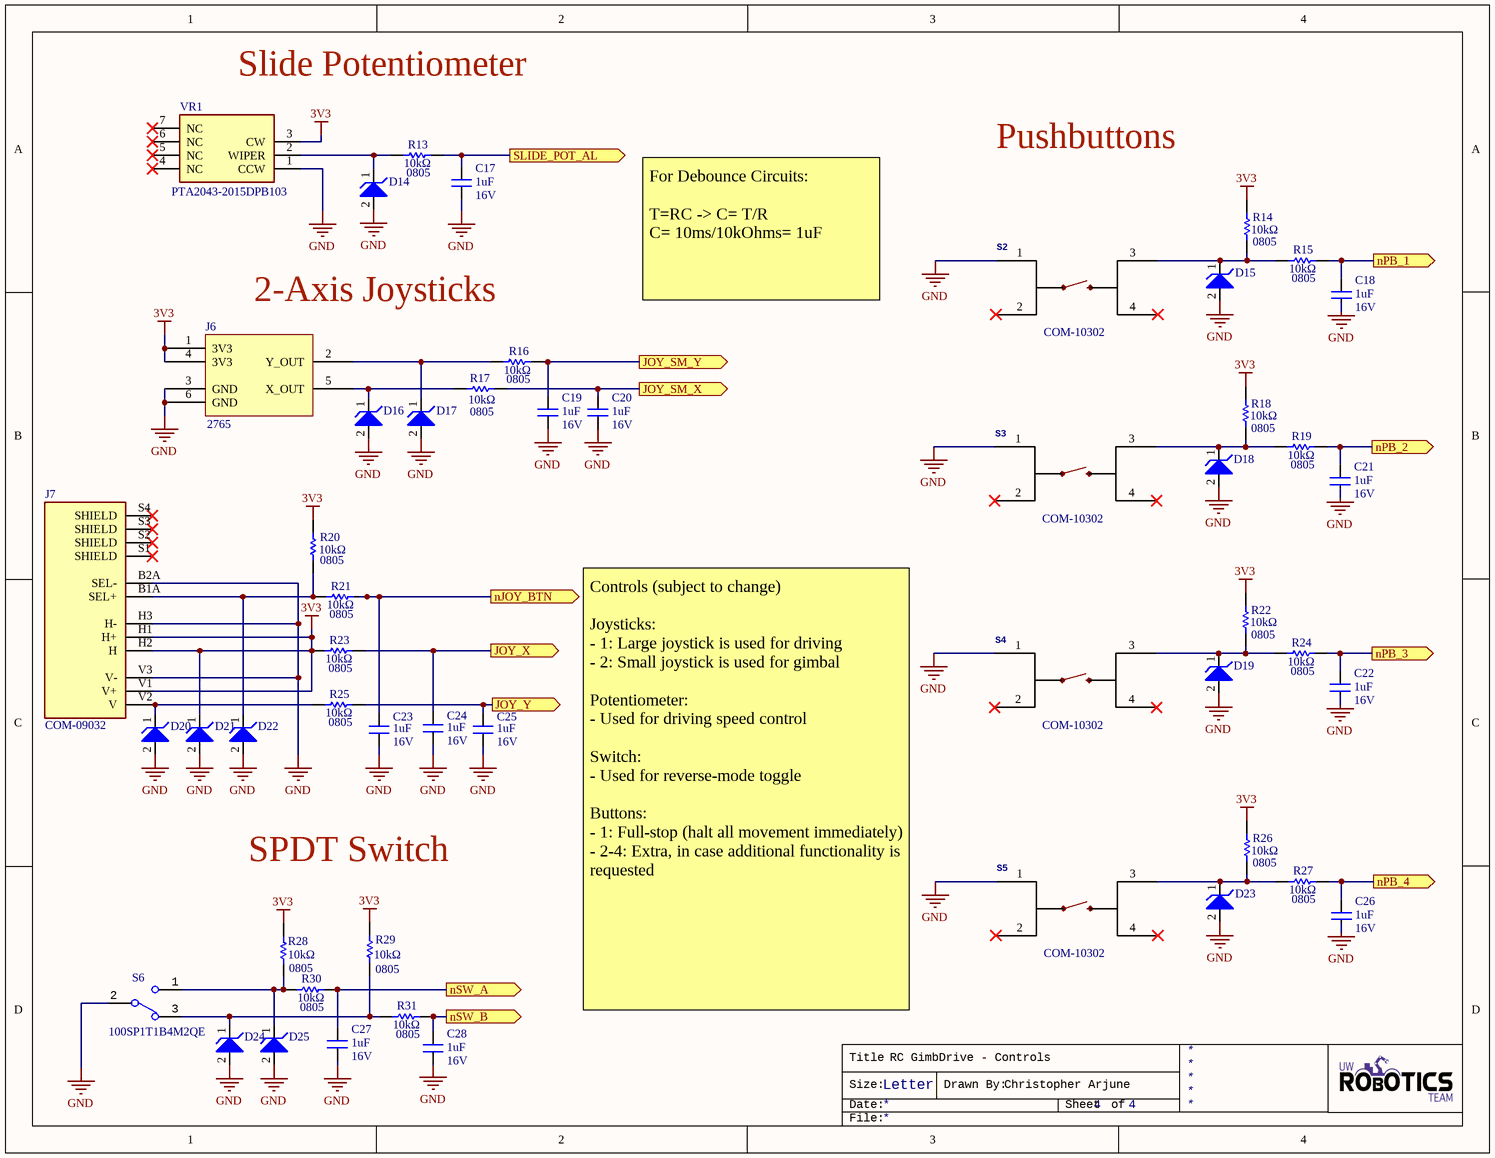
[diagram p3: SH4-CONTROLS.SchDoc]

### Parts
C17  value 1uF  Voltage Rating: 16V  [CAPC2012X140N]  (hidden comment: CAP_1uF_16V_0805)
C18  value 1uF  Voltage Rating: 16V  [CAPC2012X140N]  (hidden comment: CAP_1uF_16V_0805)
C19  value 1uF  Voltage Rating: 16V  [CAPC2012X140N]  (hidden comment: CAP_1uF_16V_0805)
C20  value 1uF  Voltage Rating: 16V  [CAPC2012X140N]  (hidden comment: CAP_1uF_16V_0805)
C21  value 1uF  Voltage Rating: 16V  [CAPC2012X140N]  (hidden comment: CAP_1uF_16V_0805)
C22  value 1uF  Voltage Rating: 16V  [CAPC2012X140N]  (hidden comment: CAP_1uF_16V_0805)
C23  value 1uF  Voltage Rating: 16V  [CAPC2012X140N]  (hidden comment: CAP_1uF_16V_0805)
C24  value 1uF  Voltage Rating: 16V  [CAPC2012X140N]  (hidden comment: CAP_1uF_16V_0805)
C25  value 1uF  Voltage Rating: 16V  [CAPC2012X140N]  (hidden comment: CAP_1uF_16V_0805)
C26  value 1uF  Voltage Rating: 16V  [CAPC2012X140N]  (hidden comment: CAP_1uF_16V_0805)
C27  value 1uF  Voltage Rating: 16V  [CAPC2012X140N]  (hidden comment: CAP_1uF_16V_0805)
C28  value 1uF  Voltage Rating: 16V  [CAPC2012X140N]  (hidden comment: CAP_1uF_16V_0805)
D14  TVS_DIODE_UNIDIR_3.3V  [SOD523]  (value not drawn)
D15  TVS_DIODE_UNIDIR_3.3V  [SOD523]  (value not drawn)
D16  TVS_DIODE_UNIDIR_3.3V  [SOD523]  (value not drawn)
D17  TVS_DIODE_UNIDIR_3.3V  [SOD523]  (value not drawn)
D18  TVS_DIODE_UNIDIR_3.3V  [SOD523]  (value not drawn)
D19  TVS_DIODE_UNIDIR_3.3V  [SOD523]  (value not drawn)
D20  TVS_DIODE_UNIDIR_3.3V  [SOD523]  (value not drawn)
D21  TVS_DIODE_UNIDIR_3.3V  [SOD523]  (value not drawn)
D22  TVS_DIODE_UNIDIR_3.3V  [SOD523]  (value not drawn)
D23  TVS_DIODE_UNIDIR_3.3V  [SOD523]  (value not drawn)
D24  TVS_DIODE_UNIDIR_3.3V  [SOD523]  (value not drawn)
D25  TVS_DIODE_UNIDIR_3.3V  [SOD523]  (value not drawn)
J6  Manufacturer Part Number 1: 2765  [2_AXIS_JOY_SMALL]  (hidden comment: 2_AXIS_JOYSTICK_SMALL)
J7  Manufacturer Part Number 1: COM-09032  [2_AXIS_JOY]  (hidden comment: 2_AXIS_JOYSTICK)
R13  value 10kΩ  Case Code (Imperial): 0805  [RESC2012X60N]  (hidden comment: RES_10kΩ_0805)
R14  value 10kΩ  Case Code (Imperial): 0805  [RESC2012X60N]  (hidden comment: RES_10kΩ_0805)
R15  value 10kΩ  Case Code (Imperial): 0805  [RESC2012X60N]  (hidden comment: RES_10kΩ_0805)
R16  value 10kΩ  Case Code (Imperial): 0805  [RESC2012X60N]  (hidden comment: RES_10kΩ_0805)
R17  value 10kΩ  Case Code (Imperial): 0805  [RESC2012X60N]  (hidden comment: RES_10kΩ_0805)
R18  value 10kΩ  Case Code (Imperial): 0805  [RESC2012X60N]  (hidden comment: RES_10kΩ_0805)
R19  value 10kΩ  Case Code (Imperial): 0805  [RESC2012X60N]  (hidden comment: RES_10kΩ_0805)
R20  value 10kΩ  Case Code (Imperial): 0805  [RESC2012X60N]  (hidden comment: RES_10kΩ_0805)
R21  value 10kΩ  Case Code (Imperial): 0805  [RESC2012X60N]  (hidden comment: RES_10kΩ_0805)
R22  value 10kΩ  Case Code (Imperial): 0805  [RESC2012X60N]  (hidden comment: RES_10kΩ_0805)
R23  value 10kΩ  Case Code (Imperial): 0805  [RESC2012X60N]  (hidden comment: RES_10kΩ_0805)
R24  value 10kΩ  Case Code (Imperial): 0805  [RESC2012X60N]  (hidden comment: RES_10kΩ_0805)
R25  value 10kΩ  Case Code (Imperial): 0805  [RESC2012X60N]  (hidden comment: RES_10kΩ_0805)
R26  value 10kΩ  Case Code (Imperial): 0805  [RESC2012X60N]  (hidden comment: RES_10kΩ_0805)
R27  value 10kΩ  Case Code (Imperial): 0805  [RESC2012X60N]  (hidden comment: RES_10kΩ_0805)
R28  value 10kΩ  Case Code (Imperial): 0805  [RESC2012X60N]  (hidden comment: RES_10kΩ_0805)
R29  value 10kΩ  Case Code (Imperial): 0805  [RESC2012X60N]  (hidden comment: RES_10kΩ_0805)
R30  value 10kΩ  Case Code (Imperial): 0805  [RESC2012X60N]  (hidden comment: RES_10kΩ_0805)
R31  value 10kΩ  Case Code (Imperial): 0805  [RESC2012X60N]  (hidden comment: RES_10kΩ_0805)
S2  Manufacturer Part Number 1: COM-10302  [TACTILE_SWITCH_PTH_12MM]  (hidden comment: Pushbutton)
S3  Manufacturer Part Number 1: COM-10302  [TACTILE_SWITCH_PTH_12MM]  (hidden comment: Pushbutton)
S4  Manufacturer Part Number 1: COM-10302  [TACTILE_SWITCH_PTH_12MM]  (hidden comment: Pushbutton)
S5  Manufacturer Part Number 1: COM-10302  [TACTILE_SWITCH_PTH_12MM]  (hidden comment: Pushbutton)
S6  SW_SPDT  [100SP1T1B4M2QE]  (value not drawn)
VR1  Manufacturer Part Number 1: PTA2043-2015DPB103  [PTA20432015CPB103]  (hidden comment: POT_10K_SLIDE)

### Ports
JOY_SM_X (out), JOY_SM_Y (out), JOY_X (out), JOY_Y (out), nJOY_BTN (out), nPB_1 (out), nPB_2 (out), nPB_3 (out), nPB_4 (out), nSW_A (out), nSW_B (out), SLIDE_POT_AL (out)

### Nets
3V3: D21.1 J6.1(3V3) J6.4(3V3) J7.H1(H+) J7.H2(H) J7.V1(V+) R14.1 R18.1 R20.1 R22.1 R23.1 R26.1 R28.1 R29.1 VR1.3(CW)
GND: C17.1 C18.1 C19.1 C20.1 C21.1 C22.1 C23.1 C24.1 C25.1 C26.1 C27.1 C28.1 D14.2 D15.2 D16.2 D17.2 D18.2 D19.2 D20.2 D21.2 D22.2 D23.2 D24.2 D25.2 J6.3(GND) J6.6(GND) J7.B2A(SEL-) J7.H3(H-) J7.V3(V-) S2.1 S3.1 S4.1 S5.1 S6.2 VR1.1(CCW)
NetC17_2: C17.2 R13.2 ; port SLIDE_POT_AL
NetC18_2: C18.2 R15.2 ; port nPB_1
NetC19_2: C19.2 R16.2 ; port JOY_SM_Y
NetC20_2: C20.2 R17.2 ; port JOY_SM_X
NetC21_2: C21.2 R19.2 ; port nPB_2
NetC22_2: C22.2 R24.2 ; port nPB_3
NetC23_2: C23.2 R21.2 ; port nJOY_BTN
NetC24_2: C24.2 R23.2 ; port JOY_X
NetC25_2: C25.2 R25.2 ; port JOY_Y
NetC26_2: C26.2 R27.2 ; port nPB_4
NetC27_2: C27.2 R30.2 ; port nSW_A
NetC28_2: C28.2 R31.2 ; port nSW_B
NetD14_1: D14.1 R13.1 VR1.2(WIPER)
NetD15_1: D15.1 R14.2 R15.1 S2.3
NetD16_1: D16.1 J6.5(X_OUT) R17.1
NetD17_1: D17.1 J6.2(Y_OUT) R16.1
NetD18_1: D18.1 R18.2 R19.1 S3.3
NetD19_1: D19.1 R22.2 R24.1 S4.3
NetD20_1: D20.1 J7.V2(V) R25.1
NetD22_1: D22.1 J7.B1A(SEL+) R20.2 R21.1
NetD23_1: D23.1 R26.2 R27.1 S5.3
NetD24_1: D24.1 R29.2 R31.1 S6.3
NetD25_1: D25.1 R28.2 R30.1 S6.1

Not connected (* = marked no-connect by the designer): J7 S1(SHIELD)* S2(SHIELD)* S3(SHIELD)* S4(SHIELD)*; S2 2* 4*; S3 2* 4*; S4 2* 4*; S5 2* 4*; VR1 4(NC)* 5(NC)* 6(NC)* 7(NC)*

### Notes on the sheet
- (near VR1) Slide Potentiometer
- Pushbuttons
- For Debounce Circuits:
  T=RC -> C= T/R
  C= 10ms/10kOhms= 1uF
- 2-Axis Joysticks
- SPDT Switch
- Controls (subject to change)
  Joysticks:
  - 1: Large joystick is used for driving
  - 2: Small joystick is used for gimbal
  Potentiometer:
  - Used for driving speed control
  Switch:
  - Used for reverse-mode toggle
  Buttons:
  - 1: Full-stop (halt all movement immediately)
  - 2-4: Extra, in case additional functionality is requested
- Title
- Size:
- Date:
- Letter
- Drawn By:
- Sheet
- of
- File:

### Library data of the parts
C17-C28 = CAP_1uF_16V_0805: as C11 on sheet SH2-MCU; Mount: Surface Mount; Case Code (Metric): 2012; Case Code (Imperial): 0805; Min Operating Temperature: -55°C; Max Operating Temperature: 125°C; Dielectric: X7R; Termination: SMD/SMT; Supplier 1: Digi-Key; Supplier Part Number 1: 311-1365-1-ND; Package: 0805 (2012 Metric)
D14-D25 = TVS_DIODE_UNIDIR_3.3V: as D5 on sheet SH2-MCU; Supplier 1: Digi-Key; Mount: Surface Mount; Number of Pins: 2; Min Operating Temperature: -55°C; Max Operating Temperature: 150°C; Reverse Standoff Voltage: 3.3V; Clamping Voltage: 14.1V; Composition: Zener; Supplier Part Number 1: ESD5Z3.3T1GOSCT-ND
J6 = 2_AXIS_JOYSTICK_SMALL: JOYSTICK 10K OHM 2 AXIS TH; Manufacturer 1: Adafruit Industries; Resistance: 10kR; Supplier 1: Digi-Key; Stock 1: 351; Pricing 1: 1=2.50000 (USD); RoHS: Yes; Mount: Through Hole; Packaging: Bulk; Length: 0.707inch; Height: 0.472inch; Width: 0.697inch; ComponentLink1URL: https://media.digikey.com/pdf/Data%20Sheets/Adafruit%20PDFs/2765_Web.pdf?src-supplier=Digi-Key; ComponentLink1Description: https://media.digikey.com/pdf/Data%20Sheets/Adafruit%20PDFs/2765_Web.pdf?src-supplier=Digi-Key; Supplier Part Number 1: 1528-1730-ND
J7 = 2_AXIS_JOYSTICK: JOYSTICK 10K OHM 2 AXIS TH; Manufacturer 1: SparkFun; Supplier 1: Digi-Key; Stock 1: 1039; Pricing 1: 1=3.95000 (USD); RoHS: No; ComponentLink1URL: https://media.digikey.com/pdf/Data%20Sheets/Sparkfun%20PDFs/COM-09032_Web.pdf?src-supplier=Digi-Key; ComponentLink1Description: https://media.digikey.com/pdf/Data%20Sheets/Sparkfun%20PDFs/COM-09032_Web.pdf?src-supplier=Digi-Key; Supplier Part Number 1: 1568-1526-ND
R13-R31 = RES_10kΩ_0805: as R5 on sheet SH2-MCU; Supplier 1: Digi-Key; Case Code (Metric): 2012; Min Operating Temperature: -55°C; Max Operating Temperature: 155°C; Resistance: 10K; Tolerance: 1%; Termination: SMD/SMT; Supplier Part Number 1: 311-10.0KCRCT-ND; Package: 0805 (2012 Metric)
S2-S5 = MOMENTARY_SWITCH_TH: Momentary Switch (Pushbutton) - SPST; Manufacturer 1: SparkFun; SymbolName_1: SWITCH-MOMENTARY-2; PROD_ID: SWCH-09185; SF_SKU: COM-09190; Package: TACTILE_SWITCH_PTH_12MM; Supplier 1: Digi-Key; Stock 1: 32; Pricing 1: 1=5.85000 (USD); RoHS: No; Mount: Through Hole; Throw Configuration: SPST; Termination: PC Pin; ComponentLink1URL: https://www.sparkfun.com/datasheets/Components/Buttons/TSA12110%20TACT%20SWITCH.jpg?src-supplier=Digi-Key; ComponentLink1Description: https://www.sparkfun.com/datasheets/Components/Buttons/TSA12110%20TACT%20SWITCH.jpg?src-supplier=Digi-Key; Supplier Part Number 1: 1568-1332-ND
S6 = SW_SPDT: SWITCH TOGGLE SPDT 5A 120V; Manufacturer 1: E-Switch; Actuator Material: Brass,Chrome; Switch Function: On-On; Voltage Rating (DC): 28V; Illumination Type: Non-Illuminated,Illuminated; Actuator Type: Standard Round; Electrical Life: 40000Cycles; Actuator Length: 12.19mm; ComponentLink1URL: https://datasheet.ciiva.com/24455/t111597-24455739.pdf?src-supplier=Onlinecomponents.com; ComponentLink1Description: https://datasheet.ciiva.com/24455/t111597-24455739.pdf?src-supplier=Onlinecomponents.com; ComponentLink2URL: https://datasheet.ciiva.com/2905/t111597-2905494.pdf?src-supplier=Digi-Key; ComponentLink2Description: https://datasheet.ciiva.com/2905/t111597-2905494.pdf?src-supplier=Digi-Key; Supplier 1: Digi-Key; Manufacturer Part Number 1: 100SP1T1B4M2QE; Stock 1: 4845; Pricing 1: 1=1.99000, 10=1.77900, 25=1.68240, 50=1.60200, 100=1.52950, 250=1.46512, 500=1.36850, 1000=1.30410 (USD); RoHS: Yes; Mount: Through Hole; Contact Material: Silver; Contact Plating: Silver; Min Operating Temperature: -30°C; Max Operating Temperature: 85°C; Package Quantity: 1; Current Rating: 5A; Voltage Rating (AC): 120V; Packaging: Bulk; Orientation: Vertical; Termination: PC Pin; Throw Configuration: SPDT; Lead Free: Lead Free; Supplier Part Number 1: EG2355-ND
VR1 = POT_10K_SLIDE: SLIDE POT 10K OHM 0.1W TOP 20MM; Manufacturer 1: Bourns; Max Power Dissipation: 100mW; Tolerance: 20%; Resistance: 10kR; Power Rating: 50mW; Number of Turns: 1; Hole Diameter: 1.2mm; Supplier 1: Digi-Key; Stock 1: 927; Pricing 1: 1=1.29000, 10=1.14000, 25=1.02600, 50=0.98800, 100=0.95000, 250=0.89300, 500=0.76000, 1000=0.70300, 5000=0.57760 (USD); RoHS: Yes; Mount: Through Hole; Min Operating Temperature: -10°C; Max Operating Temperature: 50°C; Packaging: Bulk; Composition: Potentiometer; Type: Potentiometer; Termination: Pin; Taper: Linear; Military Standard: Not; Package Quantity: 100; Length: 35mm; Height: 0.256inch; Width: 0.354inch; Depth: 9mm; ComponentLink1URL: https://datasheet.ciiva.com/6248/pta-6248511.pdf?src-supplier=Digi-Key; ComponentLink1Description: https://datasheet.ciiva.com/6248/pta-6248511.pdf?src-supplier=Digi-Key; Supplier Part Number 1: PTA2043-2015DPB103-ND; Radiation Hardening: No

## Nets that join several sheets
3V3: SH1-POWER (C3.2 R1.2 TP2.1 U1.2), SH2-MCU (17 pins), SH3-USB AND UART (D8.1 D11.1), SH4-CONTROLS (15 pins)
5V: SH1-POWER (5 pins), SH3-USB AND UART (F2.1 F3.1)
GND: SH1-POWER (9 pins), SH2-MCU (24 pins), SH3-USB AND UART (13 pins), SH4-CONTROLS (35 pins)
NetC17_2: SH2-MCU (U2.8), SH4-CONTROLS (C17.2 R13.2)
NetC18_2: SH2-MCU (U2.33), SH4-CONTROLS (C18.2 R15.2)
NetC19_2: SH2-MCU (U2.26), SH4-CONTROLS (C19.2 R16.2)
NetC20_2: SH2-MCU (U2.27), SH4-CONTROLS (C20.2 R17.2)
NetC21_2: SH2-MCU (U2.34), SH4-CONTROLS (C21.2 R19.2)
NetC22_2: SH2-MCU (U2.35), SH4-CONTROLS (C22.2 R24.2)
NetC23_2: SH2-MCU (U2.4), SH4-CONTROLS (C23.2 R21.2)
NetC24_2: SH2-MCU (U2.14), SH4-CONTROLS (C24.2 R23.2)
NetC25_2: SH2-MCU (U2.15), SH4-CONTROLS (C25.2 R25.2)
NetC26_2: SH2-MCU (U2.36), SH4-CONTROLS (C26.2 R27.2)
NetC27_2: SH2-MCU (U2.22), SH4-CONTROLS (C27.2 R30.2)
NetC28_2: SH2-MCU (U2.23), SH4-CONTROLS (C28.2 R31.2)
NetD9_1: SH2-MCU (U2.38), SH3-USB AND UART (D9.1 J4.3)
NetD10_1: SH2-MCU (U2.37), SH3-USB AND UART (D10.1 J4.2)
NetD12_1: SH2-MCU (U2.17), SH3-USB AND UART (D12.1 J5.3)
NetD13_1: SH2-MCU (U2.16), SH3-USB AND UART (D13.1 J5.2)
NetR11_1: SH2-MCU (U2.39), SH3-USB AND UART (R11.1)
NetR12_1: SH2-MCU (U2.21), SH3-USB AND UART (R12.1)
USBD_N: SH2-MCU (U2.44), SH3-USB AND UART (R9.2 TP5.1)
USBD_P: SH2-MCU (U2.45), SH3-USB AND UART (R10.2 TP6.1)